# Altium schematic sheet Sensors.SchDoc
size A; SheetNumber: 2; SheetTotal: 9
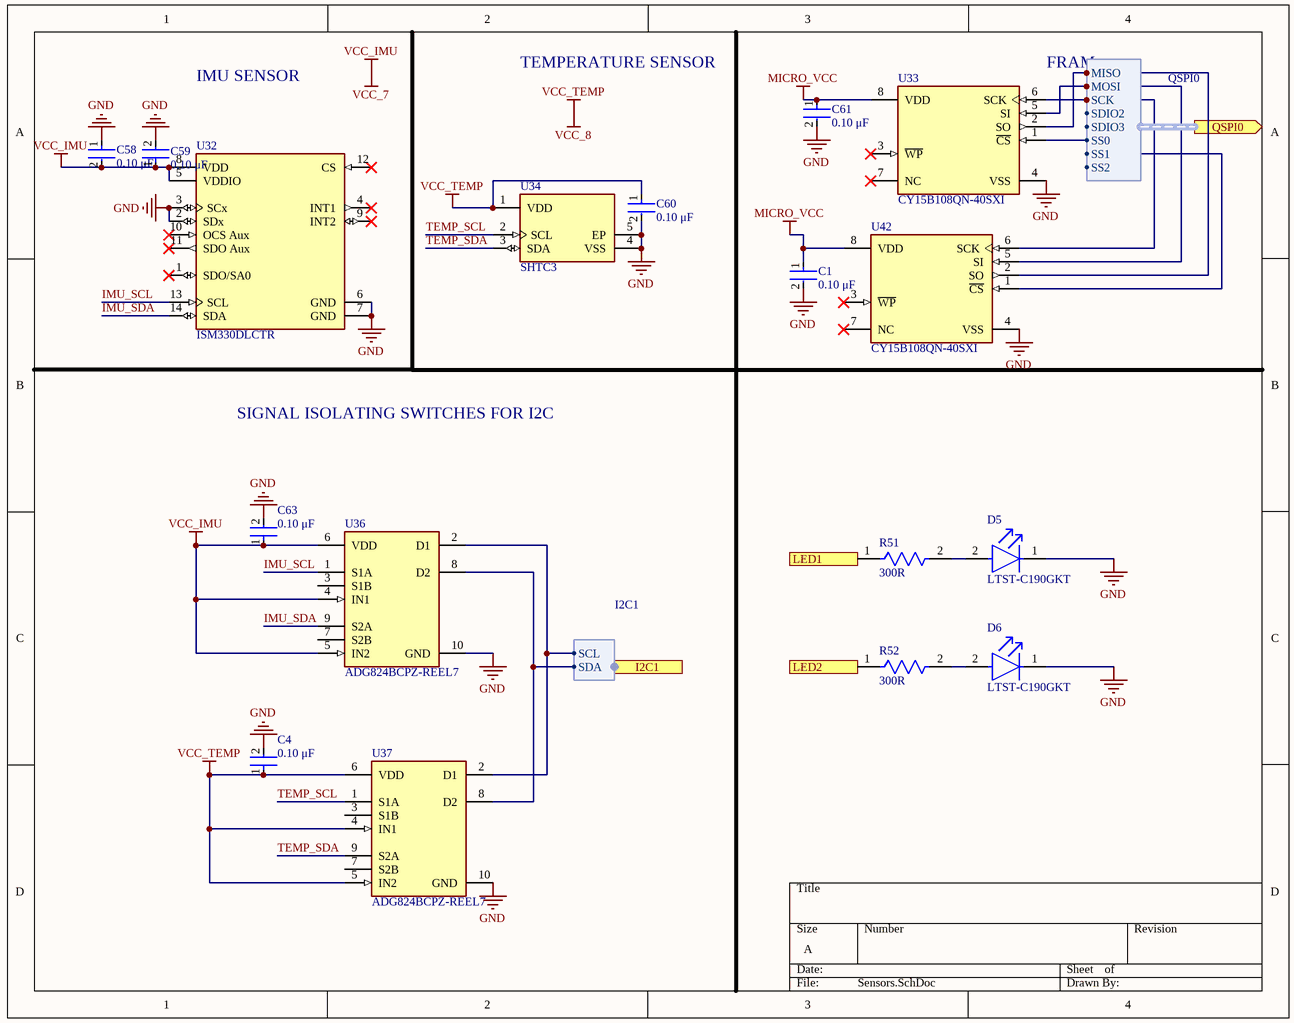
[diagram p0: Sensors.SchDoc]

## Parts
C1  Capacitance: 0.10 μF  [FP-C0402-BB-MFG]  (hidden comment: C0402C104K8PACTU)
C4  Capacitance: 0.10 μF  [FP-C0402-BB-MFG]  (hidden comment: C0402C104K8PACTU)
C58  Capacitance: 0.10 μF  [FP-C0402-BB-MFG]  (hidden comment: C0402C104K8PACTU)
C59  Capacitance: 0.10 μF  [FP-C0402-BB-MFG]  (hidden comment: C0402C104K8PACTU)
C60  Capacitance: 0.10 μF  [FP-C0402-BB-MFG]  (hidden comment: C0402C104K8PACTU)
C61  Capacitance: 0.10 μF  [FP-C0402-BB-MFG]  (hidden comment: C0402C104K8PACTU)
C63  Capacitance: 0.10 μF  [FP-C0402-BB-MFG]  (hidden comment: C0402C104K8PACTU)
D5  LTST-C190GKT  [FP-LTST-C190GKT-MFG]
D6  LTST-C190GKT  [FP-LTST-C190GKT-MFG]
R51  Resistance: 300R  [FP-CRCW0603-e3-IPC_A]  (hidden comment: CRCW0603300RFKEA)
R52  Resistance: 300R  [FP-CRCW0603-e3-IPC_A]  (hidden comment: CRCW0603300RFKEA)
U32  ISM330DLCTR  [FP-LGA-14L-DM00249496-MFG]
U33  CY15B108QN-40SXI  [FP-001-85261-IPC_C]
U34  SHTC3  [FP-SHTC3-MFG]
U36  ADG824BCPZ-REEL7  [FP-CP-10-10-MFG]
U37  ADG824BCPZ-REEL7  [FP-CP-10-10-MFG]
U42  CY15B108QN-40SXI  [FP-001-85261-IPC_C]

## Ports
I2C1 (out, harness I2C1), LED1 (in), LED2 (in), QSPI0 (out, harness QSPI0)

## Harnesses
I2C1: SCL, SDA
QSPI0: MISO, MOSI, SCK, SDIO2, SDIO3, SS0, SS1, SS2

## Nets
GND: C1.2 C4.2 C58.1 C59.2 C60.2 C61.2 C63.2 D5.1(C) D6.1(C) U32.2(SDx) U32.3(SCx) U32.6(GND) U32.7(GND) U33.4(VSS) U34.4(VSS) U34.5(EP) U36.10(GND) U37.10(GND) U42.4(VSS)
MICRO_VCC: C1.1 C61.1 U33.8(VDD) U42.8(VDD)
VCC_7: C58.2 C59.1 C63.1 U32.5(VDDIO) U32.8(VDD) U36.4(IN1) U36.5(IN2) U36.6(VDD)  [also labelled VCC_IMU]
VCC_8: C4.1 C60.1 U34.1(VDD) U37.4(IN1) U37.5(IN2) U37.6(VDD)  [also labelled VCC_TEMP]
IMU_SCL: U32.13(SCL) U36.1(S1A)
IMU_SDA: U32.14(SDA) U36.9(S2A)
LED1: R51.1 ; port LED1
LED2: R52.1 ; port LED2
TEMP_SCL: U34.2(SCL) U37.1(S1A)
TEMP_SDA: U34.3(SDA) U37.9(S2A)
NetD5_2: D5.2(A) R51.2
NetD6_2: D6.2(A) R52.2
NetU33_1: U33.1(~{CS}) ; port QSPI0.SS0
NetU33_2: U33.2(SO) U42.2(SO) ; port QSPI0.MISO
NetU33_5: U33.5(SI) U42.5(SI) ; port QSPI0.MOSI
NetU33_6: U33.6(SCK) U42.6(SCK) ; port QSPI0.SCK
NetU36_2: U36.2(D1) U37.2(D1) ; port I2C1.SCL
NetU36_8: U36.8(D2) U37.8(D2) ; port I2C1.SDA
NetU42_1: U42.1(~{CS}) ; port QSPI0.SS1

Not connected (* = marked no-connect by the designer): U32 1(SDO/SA0)* 4(INT1)* 9(INT2)* 10(OCS_Aux)* 11(SDO_Aux)* 12(CS)*; U33 3(~{WP})* 7(NC)*; U36 3(S1B) 7(S2B); U37 3(S1B) 7(S2B); U42 3(~{WP})* 7(NC)*

## Notes on the sheet
- IMU SENSOR
- TEMPERATURE SENSOR
- (near U33) FRAM
- SIGNAL ISOLATING SWITCHES FOR I2C

## Library data of the parts
C1 C4 C58-C61 C63 = CMP-2008-02046-2: CAP CER 0.1UF 10V X5R 0402; Manufacturer: Kemet; Material: Ceramic; Temperature Coefficient: 15%; Tolerance: 0.1; Value: 0.10 μF; Package: C0402-BB; Temperature: -55°C to +125°C; ComponentLink2Description: Datasheet; Temperature Characteristic: X5R; Device Class L1: Passive Components; Height: 0.55mm; Lead Free: Yes; ComponentLink2URL: https://content.kemet.com/datasheets/KEM_C1002_X7R_SMD.pdf; Device Class L2: Capacitors; Temperature Range Low: -55°C; Temperature Range High: +125°C; RoHS: TRUE; Octopart: https://octopart.com/c0402c104k8pactu-kemet-140039; Automotive: No; Mouser Description: Capacitor 100 nF 10 VDC 0402; Category: Cap; Voltage Rating: 10 V; Digikey Description: CAP CER 0.1UF 10V X5R 0402; Ipc Land Pattern Name: CAPC10050X50; Device Class L3: Ceramic Capacitors; Manufacturer Part Number: C0402C104K8PACTU
D5 D6 = CMP-22017-000005-2: LED GREEN CLEAR CHIP SMD; Dominant Wavelength: 569nm; Reverse Voltage: 5V; Lens Color: Colorless; Viewing Angle: 130°; Voltage: 2V; Forward Current: 30mA; Power Dissipation: 100mW; Luminous Intensity: 6mcd; Number of LEDs: 1; Forward Voltage: 2.1V; Wavelength: 565nm; Test Current: 10mA; Min Operating Temperature: -55°C; Lens Style: Clear; Mount: Surface Mount; Width: 0.8mm; Packaging: Tape and Reel; Lens Transparency: Clear; Case Code (Metric): 1608; Depth: 0.8mm; Case Code (Imperial): 0603; Case/Package: 0603; Number of Pins: 2; Max Operating Temperature: 85°C; Lead Free: Lead Free; Number of Elements: 1; Length: 1.6mm; Height: 0.8mm; Package Quantity: 1; Power Rating: 100mW; Radiation Hardening: No; Illumination Color: Green; Color: Green
R51 R52 = CMP-2000-03216-2: RES Thick Film, 300Ω, 1%, 0.1W, 100ppm/°C, 0603; Voltage Rating (DC): 75V; Power Rating: 100mW; Length: 1.55mm; Height: 0.45mm; Case/Package: 0603; Temperature Coefficient: 100ppm/°C; Packaging: Tape and Reel; Termination: SMD/SMT; Depth: 0.85mm; Max Operating Temperature: 155°C; Radiation Hardening: No; Tolerance: 1%; Lead Free: Lead Free; Case Code (Metric): 1608; Voltage Rating: 75V; Weight: 7.1E-05oz; Package Quantity: 10; Military Standard: Not; Case Code (Imperial): 0603; Composition: Thick Film; Min Operating Temperature: -55°C; Width: 0.033inch; Number of Terminations: 2; Mount: Surface Mount; Features: Automotive AEC-Q200; Contact Plating: Tin; Max Power Dissipation: 100mW
U32 = CMP-12177-000013-1: INEMO INERTIAL MODULE; Manufacturer: STMicroelectronics; Accel Range: 2/4/8/16g; Min Supply Voltage: 1.62V; Sensor Type: Temperature,Accelerometer,Gyroscope; Gyro Range: 125/250/500/1000/2000°/s; Sensor Output: I2C,SPI; Max Supply Voltage: 3.6V; Operating Supply Current: 0.35-0.75mA; Manufacturer Part Number: ISM330DLCTR; Category: IC; Height: 0.86mm; Octopart: https://octopart.com/ism330dlctr-stmicroelectronics-85149243; Device Class L2: Motion Sensors; Temperature Range Low: -40°C; Device Class L1: Sensors; Digikey Description: INEMO INERTIAL MODULE; Lead Free: Yes; Device Class L3: Inertial Measurement Units (IMUs); ComponentLink2URL: https://www.st.com/resource/en/datasheet/ism330dlc.pdf; Package: LGA-14L-DM00249496; RoHS: TRUE; Automotive: No; Footprint Url: https://www.st.com/content/ccc/resource/technical/document/technical_note/73/17/9c/16/dd/96/4a/01/CD00134799.pdf/files/CD00134799.pdf/jcr:content/translations/en.CD00134799.pdf; Temperature Range High: +85°C; Temperature: -40°C to +85°C; ComponentLink2Description: Datasheet
U33 U42 = CMP-12945-000022-1: IC FRAM 8MBIT 40MHZ 8EIAJ; RoHS Compliant: Yes
U34 = CMP-144040-000003-1: SENSOR HUMI/TEMP I2C 2% SMD; Manufacturer: Sensirion; Operating Supply Current: 0.3-900uA; Resolution: 16bits; Min Supply Voltage: 1.62V; Max Supply Voltage: 3.6V; Category: IC; Device Class L3: unset; ComponentLink2URL: https://www.sensirion.com/fileadmin/user_upload/customers/sensirion/Dokumente/0_Datasheets/Humidity/Sensirion_Humidity_Sensors_SHTC3_Datasheet.pdf; Ipc Land Pattern Name: DFN200X200X75-4; RoHS: TRUE; Height: 0.75mm; Interface: I2C; Temperature Range High: +125°C; Accuracy: 2%; Sensor Output: I2C; Automotive: No; Package: 0; Device Class L1: Sensors; Manufacturer Part Number: SHTC3; Digikey Description: SENSOR HUMI/TEMP I2C 2% SMD; Lead Free: Yes; Temperature: -40°C to +125°C; Device Class L2: Temperature and Humidity Sensors; ComponentLink2Description: Datasheet; Octopart: https://octopart.com/shtc3-sensirion-91912225; Mouser Description: SHTC3 Series 0 to 100% RH 3.6 V Humidity and Temperature Sensor IC - DFN-4; Temperature Range Low: -40°C
U36 U37 = CMP-09113-000012-1: IC SWITCH DUAL SPDT 10LFCSP; Manufacturer: Analog Devices; Nominal Supply Current: 0.003uA; Max Supply Voltage: 3.6V; Interface: LVCMOS; On State Resistance: 0.5Ω; -3Db Bandwith: 90MHz; Number Of Circuits: 2; Mux Demux Ratio: 1:2; Standoff Height: 0.02mm; Min Supply Voltage: 1.65V; Temperature: -40°C to +85°C; ComponentLink2URL: https://www.analog.com/media/en/technical-documentation/data-sheets/ADG824.pdf; Device Class L2: Interface ICs; Octopart: https://octopart.com/adg824bcpz-reel7-analog+devices-12410880; Temperature Range High: +85°C; Manufacturer Part Number: ADG824BCPZ-REEL7; Lead Free: Yes; Temperature Range Low: -40°C; ComponentLink2Description: Datasheet; Footprint Url: https://www.analog.com/media/en/symbols-footprints/symbols/ADG824BCPZ-REEL7.bxl; RoHS: TRUE; Device Class L3: Analog Switches; Device Class L1: Integrated Circuits (ICs); Automotive: No; Height: 0.6mm; Package: CP-10-10; Throw Configuration: SPDT; Category: IC; Digikey Description: IC SWITCH DUAL SPDT 10LFCSP